# EAGLE schematic USBload (EAGLE 9.1.0)
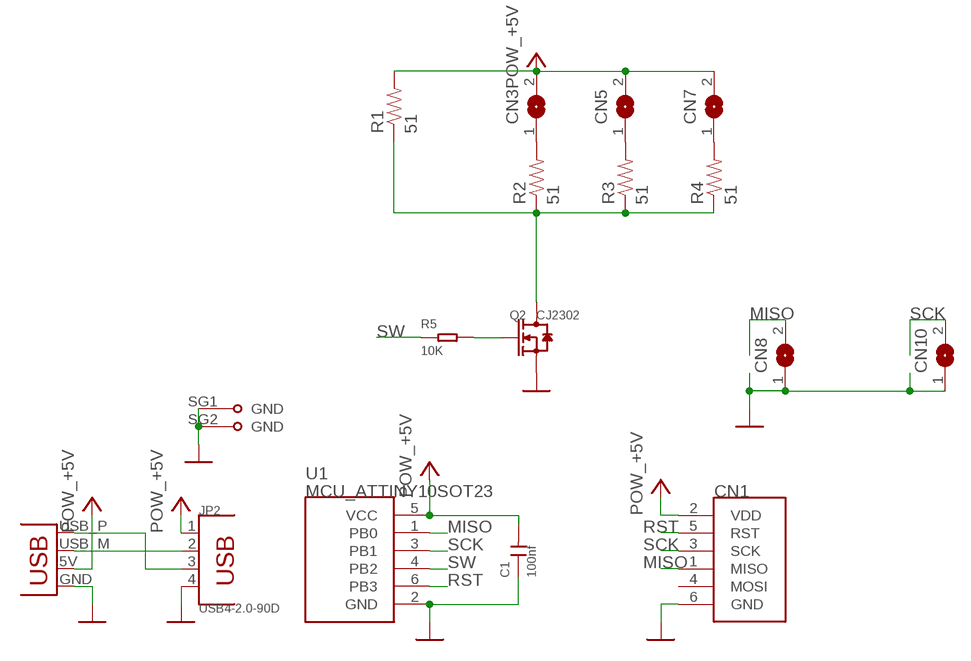
[diagram p0: schematic, sheet 1]

## Parts
C1  100nf  CERAMIC-100NF-50V-10%-X7R(0603)  [C0603]
CN1  CON_AVRISPTH  [2X03R]
CN3  JUMPER_SJ  [JUMPER_SJ]
CN5  JUMPER_SJ  [JUMPER_SJ]
CN7  JUMPER_SJ  [JUMPER_SJ]
CN8  JUMPER_SJ  [JUMPER_SJ]
CN10  JUMPER_SJ  [JUMPER_SJ]
JP1  CON_USBPCB  [USB-A-PCB]
JP2  USB4-2.0-90D  DIP-USB-A-TYPE-FMAL(4+2P-2.0-90D)  [USB4+2P-2.0-90D]
Q2  CJ2302  SMD-MOSFET-N-CH-20V-2.1A-CJ2302(SOT-23)  [SOT-23]
R1  51  RES0805  [0805]
R2  51  RES0805  [0805]
R3  51  RES0805  [0805]
R4  51  RES0805  [0805]
R5  10K  SMD-RES-10K-1%-1/10W(0603)  [R0603]
U1  MCU_ATTINY10SOT23  [SOT23-6]

## Nets
+5V: C1.2 CN1.2(VDD) CN3.2 CN5.2 CN7.2 JP1.5V(VBUS) JP2.1 R1.2 U1.5(VCC) ; supply symbol labelled POW_+5V
GND: C1.1 CN1.6(GND) CN8.1 CN10.1 JP1.GND JP2.4 JP2.SG1(GND) JP2.SG2(GND) Q2.2(S) U1.2(GND) ; supply symbol labelled POW_GND
MISO: CN1.1(MISO) CN8.2 U1.1(PB0)
N$1: JP1.USB_M(D-) JP2.2
N$2: JP1.USB_P(D+) JP2.3
N$4: CN5.1 R3.2
N$5: CN3.1 R2.2
N$6: CN7.1 R4.2
N$7: Q2.1(G) R5.2
N$8: Q2.3(D) R1.1 R2.1 R3.1 R4.1
RST: CN1.5(RST) U1.6(PB3)
SCK: CN1.3(SCK) CN10.2 U1.3(PB1)
SW: R5.1 U1.4(PB2)
Unconnected: CN1.4(MOSI)

## Library data of the parts
C1 = Seeed-Capacitor:CERAMIC-100NF-50V-10%-X7R(0603): 302010138; MPN: CC0603KRX7R9BB104
CN1 = akita:CON_AVRISP: AVR ISP standard 2x3 connector
CN3 CN5 CN7 CN8 CN10 = akita:JUMPER_SJ: SMD solder JUMPER
JP1 = akita:CON_USB: USB Connectors USB-B-PTH is fully proven SKU : PRT-00139/CONN-08278 USB-miniB is fully proven SKU : PRT-00587 USB-A-PCB is untested. USB-A-H is throughly reviewed, but untested. Spark Fun Electronics SKU : PRT-00437 USB-B-SMT is throughly reviewed, but untested. Needs silkscreen touching up. USB-A-S has not been used/tested USB-MB-H has not been used/tested USB-MICROB has been used. CONN-09505
JP2 = Seeed-Connector:DIP-USB-A-TYPE-FMAL(4+2P-2.0-90D): 320010007
Q2 = Seeed-Transistor:SMD-MOSFET-N-CH-20V-2.1A-CJ2302(SOT-23): 305030015; MPN: CJ2302
R1-R4 = akita:RES: Resistor Basic schematic elements and footprints for 0603, 1206, and PTH resistors.
R5 = Seeed-Resistor:SMD-RES-10K-1%-1/10W(0603): 301010299; MPN: RC0603FR-0710KL
U1 = akita:MCU_ATTINY10